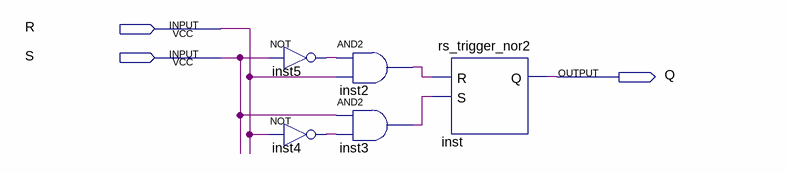
[diagram p0: schematic sheet]
// Quartus schematic rs_trigger_nor2_forbidden_block.bdf as structural Verilog: 5 symbols, 3 pins
module rs_trigger_nor2_forbidden_block (
  input  R,
  input  S,
  output Q
);

  wire inst2_out, inst3_out, inst4_out, inst5_out;

  not inst5 (inst5_out, S);
  not inst4 (inst4_out, R);
  and inst2 (inst2_out, inst5_out, R);
  and inst3 (inst3_out, S, inst4_out);
  rs_trigger_nor2 inst (.R(inst2_out), .S(inst3_out), .Q(Q));
endmodule
